# EAGLE design BigFrontplane (EAGLE 6.6.0)
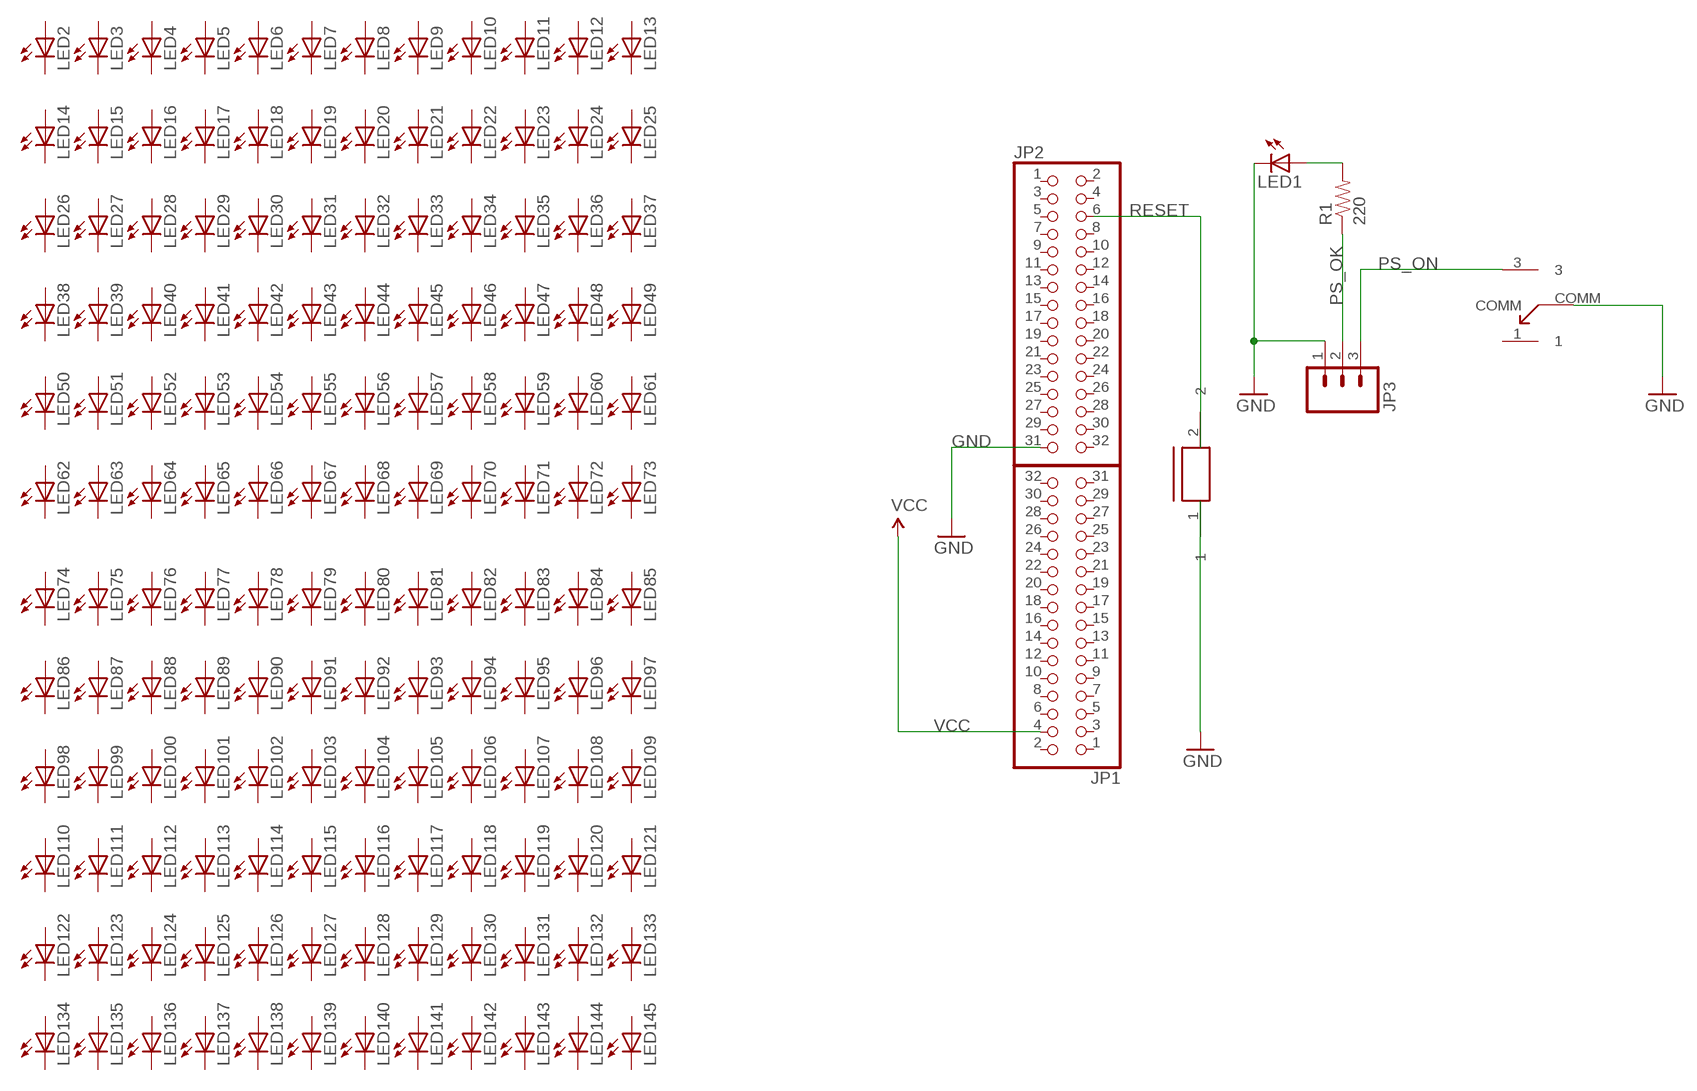
[diagram p0: schematic, sheet 1]

## Parts
JP1  PINHD-2X16  [2X16]
JP2  PINHD-2X16  [2X16]
JP3  M03LONGPADS  [1X03_LONGPADS]
LED1  LED5MM  [LED5MM]
LED2  LED3MM  [LED3MM]
LED3  LED3MM  [LED3MM]
LED4  LED3MM  [LED3MM]
LED5  LED3MM  [LED3MM]
LED6  LED3MM  [LED3MM]
LED7  LED3MM  [LED3MM]
LED8  LED3MM  [LED3MM]
LED9  LED3MM  [LED3MM]
LED10  LED3MM  [LED3MM]
LED11  LED3MM  [LED3MM]
LED12  LED3MM  [LED3MM]
LED13  LED3MM  [LED3MM]
LED14  LED3MM  [LED3MM]
LED15  LED3MM  [LED3MM]
LED16  LED3MM  [LED3MM]
LED17  LED3MM  [LED3MM]
LED18  LED3MM  [LED3MM]
LED19  LED3MM  [LED3MM]
LED20  LED3MM  [LED3MM]
LED21  LED3MM  [LED3MM]
LED22  LED3MM  [LED3MM]
LED23  LED3MM  [LED3MM]
LED24  LED3MM  [LED3MM]
LED25  LED3MM  [LED3MM]
LED26  LED3MM  [LED3MM]
LED27  LED3MM  [LED3MM]
LED28  LED3MM  [LED3MM]
LED29  LED3MM  [LED3MM]
LED30  LED3MM  [LED3MM]
LED31  LED3MM  [LED3MM]
LED32  LED3MM  [LED3MM]
LED33  LED3MM  [LED3MM]
LED34  LED3MM  [LED3MM]
LED35  LED3MM  [LED3MM]
LED36  LED3MM  [LED3MM]
LED37  LED3MM  [LED3MM]
LED38  LED3MM  [LED3MM]
LED39  LED3MM  [LED3MM]
LED40  LED3MM  [LED3MM]
LED41  LED3MM  [LED3MM]
LED42  LED3MM  [LED3MM]
LED43  LED3MM  [LED3MM]
LED44  LED3MM  [LED3MM]
LED45  LED3MM  [LED3MM]
LED46  LED3MM  [LED3MM]
LED47  LED3MM  [LED3MM]
LED48  LED3MM  [LED3MM]
LED49  LED3MM  [LED3MM]
LED50  LED3MM  [LED3MM]
LED51  LED3MM  [LED3MM]
LED52  LED3MM  [LED3MM]
LED53  LED3MM  [LED3MM]
LED54  LED3MM  [LED3MM]
LED55  LED3MM  [LED3MM]
LED56  LED3MM  [LED3MM]
LED57  LED3MM  [LED3MM]
LED58  LED3MM  [LED3MM]
LED59  LED3MM  [LED3MM]
LED60  LED3MM  [LED3MM]
LED61  LED3MM  [LED3MM]
LED62  LED3MM  [LED3MM]
LED63  LED3MM  [LED3MM]
LED64  LED3MM  [LED3MM]
LED65  LED3MM  [LED3MM]
LED66  LED3MM  [LED3MM]
LED67  LED3MM  [LED3MM]
LED68  LED3MM  [LED3MM]
LED69  LED3MM  [LED3MM]
LED70  LED3MM  [LED3MM]
LED71  LED3MM  [LED3MM]
LED72  LED3MM  [LED3MM]
LED73  LED3MM  [LED3MM]
LED74  LED3MM  [LED3MM]
LED75  LED3MM  [LED3MM]
LED76  LED3MM  [LED3MM]
LED77  LED3MM  [LED3MM]
LED78  LED3MM  [LED3MM]
LED79  LED3MM  [LED3MM]
LED80  LED3MM  [LED3MM]
LED81  LED3MM  [LED3MM]
LED82  LED3MM  [LED3MM]
LED83  LED3MM  [LED3MM]
LED84  LED3MM  [LED3MM]
LED85  LED3MM  [LED3MM]
LED86  LED3MM  [LED3MM]
LED87  LED3MM  [LED3MM]
LED88  LED3MM  [LED3MM]
LED89  LED3MM  [LED3MM]
LED90  LED3MM  [LED3MM]
LED91  LED3MM  [LED3MM]
LED92  LED3MM  [LED3MM]
LED93  LED3MM  [LED3MM]
LED94  LED3MM  [LED3MM]
LED95  LED3MM  [LED3MM]
LED96  LED3MM  [LED3MM]
LED97  LED3MM  [LED3MM]
LED98  LED3MM  [LED3MM]
LED99  LED3MM  [LED3MM]
LED100  LED3MM  [LED3MM]
LED101  LED3MM  [LED3MM]
LED102  LED3MM  [LED3MM]
LED103  LED3MM  [LED3MM]
LED104  LED3MM  [LED3MM]
LED105  LED3MM  [LED3MM]
LED106  LED3MM  [LED3MM]
LED107  LED3MM  [LED3MM]
LED108  LED3MM  [LED3MM]
LED109  LED3MM  [LED3MM]
LED110  LED3MM  [LED3MM]
LED111  LED3MM  [LED3MM]
LED112  LED3MM  [LED3MM]
LED113  LED3MM  [LED3MM]
LED114  LED3MM  [LED3MM]
LED115  LED3MM  [LED3MM]
LED116  LED3MM  [LED3MM]
LED117  LED3MM  [LED3MM]
LED118  LED3MM  [LED3MM]
LED119  LED3MM  [LED3MM]
LED120  LED3MM  [LED3MM]
LED121  LED3MM  [LED3MM]
LED122  LED3MM  [LED3MM]
LED123  LED3MM  [LED3MM]
LED124  LED3MM  [LED3MM]
LED125  LED3MM  [LED3MM]
LED126  LED3MM  [LED3MM]
LED127  LED3MM  [LED3MM]
LED128  LED3MM  [LED3MM]
LED129  LED3MM  [LED3MM]
LED130  LED3MM  [LED3MM]
LED131  LED3MM  [LED3MM]
LED132  LED3MM  [LED3MM]
LED133  LED3MM  [LED3MM]
LED134  LED3MM  [LED3MM]
LED135  LED3MM  [LED3MM]
LED136  LED3MM  [LED3MM]
LED137  LED3MM  [LED3MM]
LED138  LED3MM  [LED3MM]
LED139  LED3MM  [LED3MM]
LED140  LED3MM  [LED3MM]
LED141  LED3MM  [LED3MM]
LED142  LED3MM  [LED3MM]
LED143  LED3MM  [LED3MM]
LED144  LED3MM  [LED3MM]
LED145  LED3MM  [LED3MM]
R1  220  RESISTORKIT  [AXIAL-0.3-KIT]
U$1  7101  [7101SYCQE]
U$2  TP11  [TP11]

## Nets
GND: JP2.31 JP3.1 LED1.K(C) U$1.COMM U$2.1
N$1: LED1.A R1.P$2
PS_OK: JP3.2 R1.P$1
PS_ON: JP3.3 U$1.3
RESET: JP2.6 U$2.2
VCC: JP1.4
Unconnected: JP1.1 JP1.2 JP1.3 JP1.5 JP1.6 JP1.7 JP1.8 JP1.9 JP1.10 JP1.11 JP1.12 JP1.13 JP1.14 JP1.15 JP1.16 JP1.17 JP1.18 JP1.19 JP1.20 JP1.21 JP1.22 JP1.23 JP1.24 JP1.25 JP1.26 JP1.27 JP1.28 JP1.29 JP1.30 JP1.31 JP1.32 JP2.1 JP2.2 JP2.3 JP2.4 JP2.5 JP2.7 JP2.8 JP2.9 JP2.10 JP2.11 JP2.12 JP2.13 JP2.14 JP2.15 JP2.16 JP2.17 JP2.18 JP2.19 JP2.20 JP2.21 JP2.22 JP2.23 JP2.24 JP2.25 JP2.26 JP2.27 JP2.28 JP2.29 JP2.30 JP2.32 LED2.A LED2.K(C) LED3.A LED3.K(C) LED4.A LED4.K(C) LED5.A LED5.K(C) LED6.A LED6.K(C) LED7.A LED7.K(C) LED8.A LED8.K(C) LED9.A LED9.K(C) LED10.A LED10.K(C) LED11.A LED11.K(C) LED12.A LED12.K(C) LED13.A LED13.K(C) LED14.A LED14.K(C) LED15.A LED15.K(C) LED16.A LED16.K(C) LED17.A LED17.K(C) LED18.A LED18.K(C) LED19.A LED19.K(C) LED20.A LED20.K(C) LED21.A LED21.K(C) LED22.A LED22.K(C) LED23.A LED23.K(C) LED24.A LED24.K(C) LED25.A LED25.K(C) LED26.A LED26.K(C) LED27.A LED27.K(C) LED28.A LED28.K(C) LED29.A LED29.K(C) LED30.A LED30.K(C) LED31.A LED31.K(C) LED32.A LED32.K(C) LED33.A LED33.K(C) LED34.A LED34.K(C) LED35.A LED35.K(C) LED36.A LED36.K(C) LED37.A LED37.K(C) LED38.A LED38.K(C) LED39.A LED39.K(C) LED40.A LED40.K(C) LED41.A LED41.K(C) LED42.A LED42.K(C) LED43.A LED43.K(C) LED44.A LED44.K(C) LED45.A LED45.K(C) LED46.A LED46.K(C) LED47.A LED47.K(C) LED48.A LED48.K(C) LED49.A LED49.K(C) LED50.A LED50.K(C) LED51.A LED51.K(C) LED52.A LED52.K(C) LED53.A LED53.K(C) LED54.A LED54.K(C) LED55.A LED55.K(C) LED56.A LED56.K(C) LED57.A LED57.K(C) LED58.A LED58.K(C) LED59.A LED59.K(C) LED60.A LED60.K(C) LED61.A LED61.K(C) LED62.A LED62.K(C) LED63.A LED63.K(C) LED64.A LED64.K(C) LED65.A LED65.K(C) LED66.A LED66.K(C) LED67.A LED67.K(C) LED68.A LED68.K(C) LED69.A LED69.K(C) LED70.A LED70.K(C) LED71.A LED71.K(C) LED72.A LED72.K(C) LED73.A LED73.K(C) LED74.A LED74.K(C) LED75.A LED75.K(C) LED76.A LED76.K(C) LED77.A LED77.K(C) LED78.A LED78.K(C) LED79.A LED79.K(C) LED80.A LED80.K(C) LED81.A LED81.K(C) LED82.A LED82.K(C) LED83.A LED83.K(C) LED84.A LED84.K(C) LED85.A LED85.K(C) LED86.A LED86.K(C) LED87.A LED87.K(C) LED88.A LED88.K(C) LED89.A LED89.K(C) LED90.A LED90.K(C) LED91.A LED91.K(C) LED92.A LED92.K(C) LED93.A LED93.K(C) LED94.A LED94.K(C) LED95.A LED95.K(C) LED96.A LED96.K(C) LED97.A LED97.K(C) LED98.A LED98.K(C) LED99.A LED99.K(C) LED100.A LED100.K(C) LED101.A LED101.K(C) LED102.A LED102.K(C) LED103.A LED103.K(C) LED104.A LED104.K(C) LED105.A LED105.K(C) LED106.A LED106.K(C) LED107.A LED107.K(C) LED108.A LED108.K(C) LED109.A LED109.K(C) LED110.A LED110.K(C) LED111.A LED111.K(C) LED112.A LED112.K(C) LED113.A LED113.K(C) LED114.A LED114.K(C) LED115.A LED115.K(C) LED116.A LED116.K(C) LED117.A LED117.K(C) LED118.A LED118.K(C) LED119.A LED119.K(C) LED120.A LED120.K(C) LED121.A LED121.K(C) LED122.A LED122.K(C) LED123.A LED123.K(C) LED124.A LED124.K(C) LED125.A LED125.K(C) LED126.A LED126.K(C) LED127.A LED127.K(C) LED128.A LED128.K(C) LED129.A LED129.K(C) LED130.A LED130.K(C) LED131.A LED131.K(C) LED132.A LED132.K(C) LED133.A LED133.K(C) LED134.A LED134.K(C) LED135.A LED135.K(C) LED136.A LED136.K(C) LED137.A LED137.K(C) LED138.A LED138.K(C) LED139.A LED139.K(C) LED140.A LED140.K(C) LED141.A LED141.K(C) LED142.A LED142.K(C) LED143.A LED143.K(C) LED144.A LED144.K(C) LED145.A LED145.K(C) U$1.1

## Library data of the parts
JP1 JP2 = pinhead:PINHD-2X16: PIN HEADER
JP3 = SparkFun-Connectors:M03: Header 3 Standard 3-pin 0.1" header. Use with straight break away headers (SKU : PRT-00116), right angle break away headers (PRT-00553), swiss pins (PRT-00743), machine pins (PRT-00117), and female headers (PRT-00115). Molex polarized connector foot print use with SKU : PRT-08232 with associated crimp pins and housings.
LED1 = led:LED: LED
LED2-LED145 = adafruit:LED: LED
R1 = SparkFun-Resistors:RESISTOR: Resistor Basic schematic elements and footprints for 0603, 1206, and PTH resistors.
U$1 = C&K:7101
U$2 = C&K:TP11

## Board
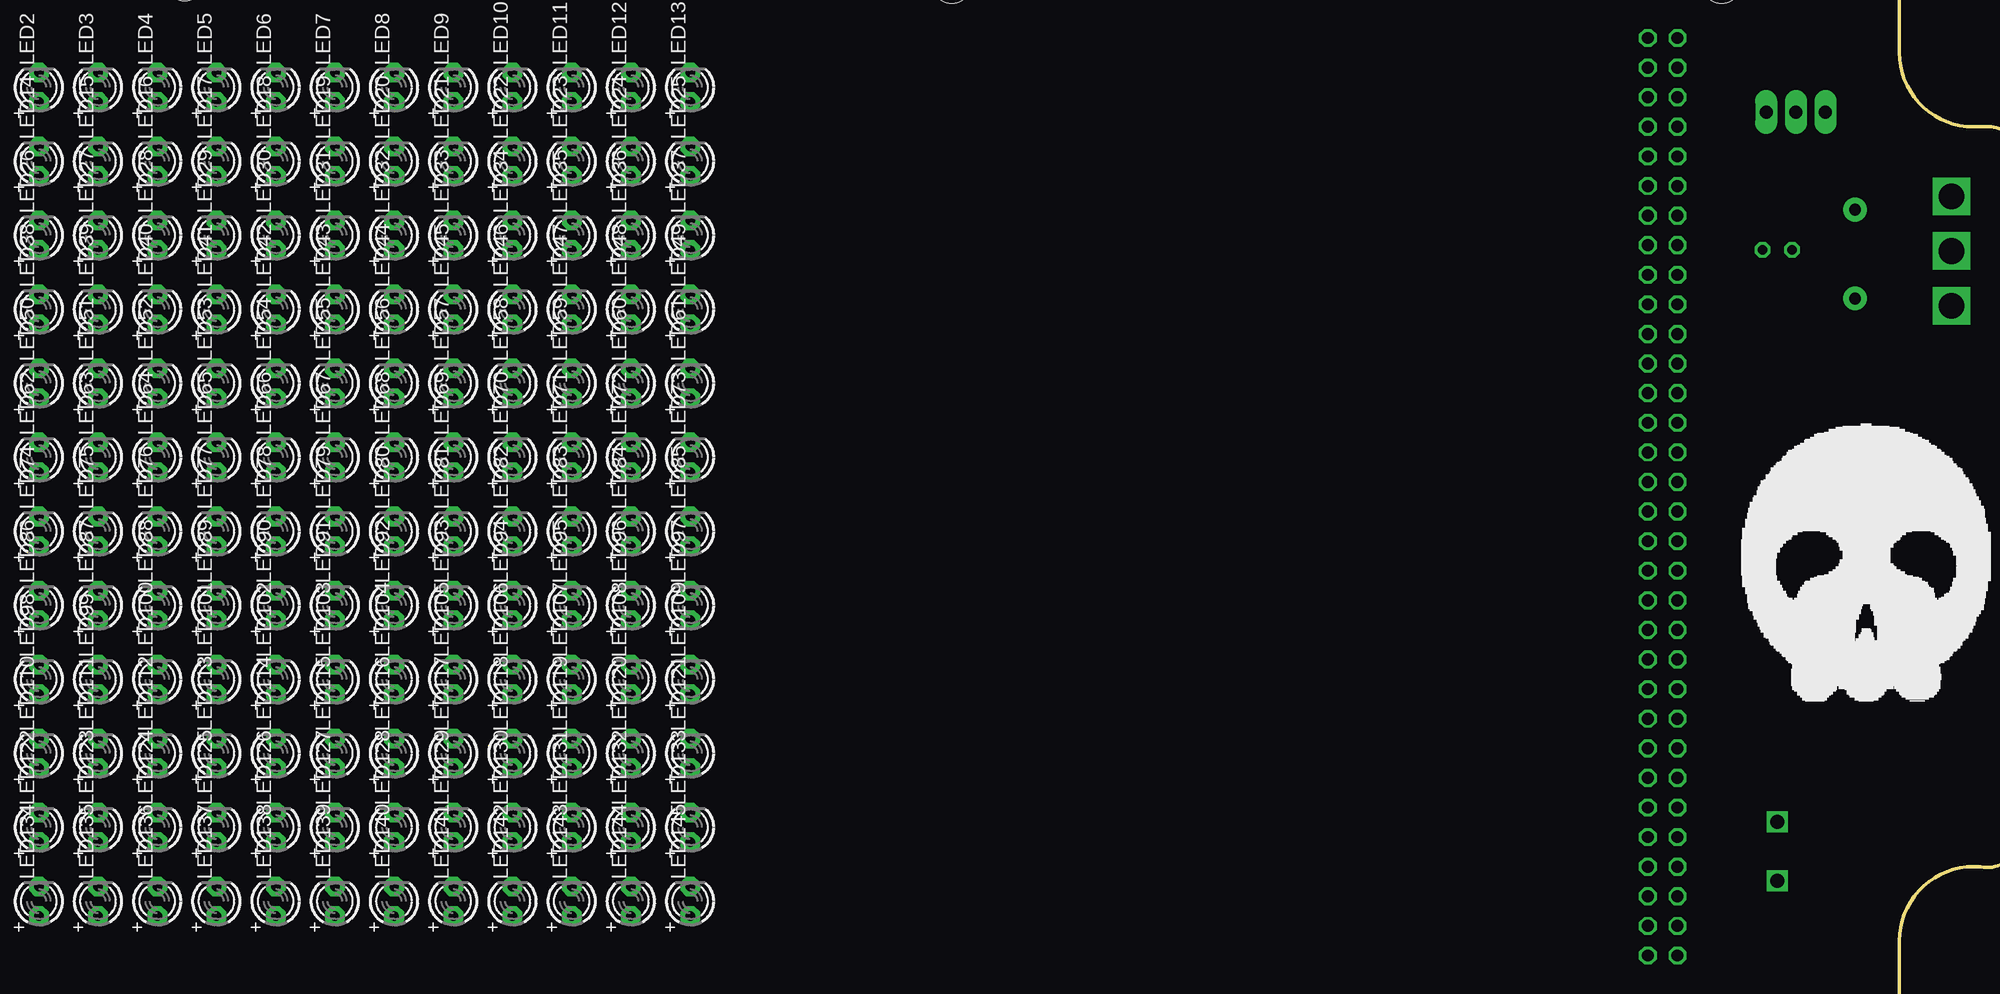
[diagram p1: board, top side]
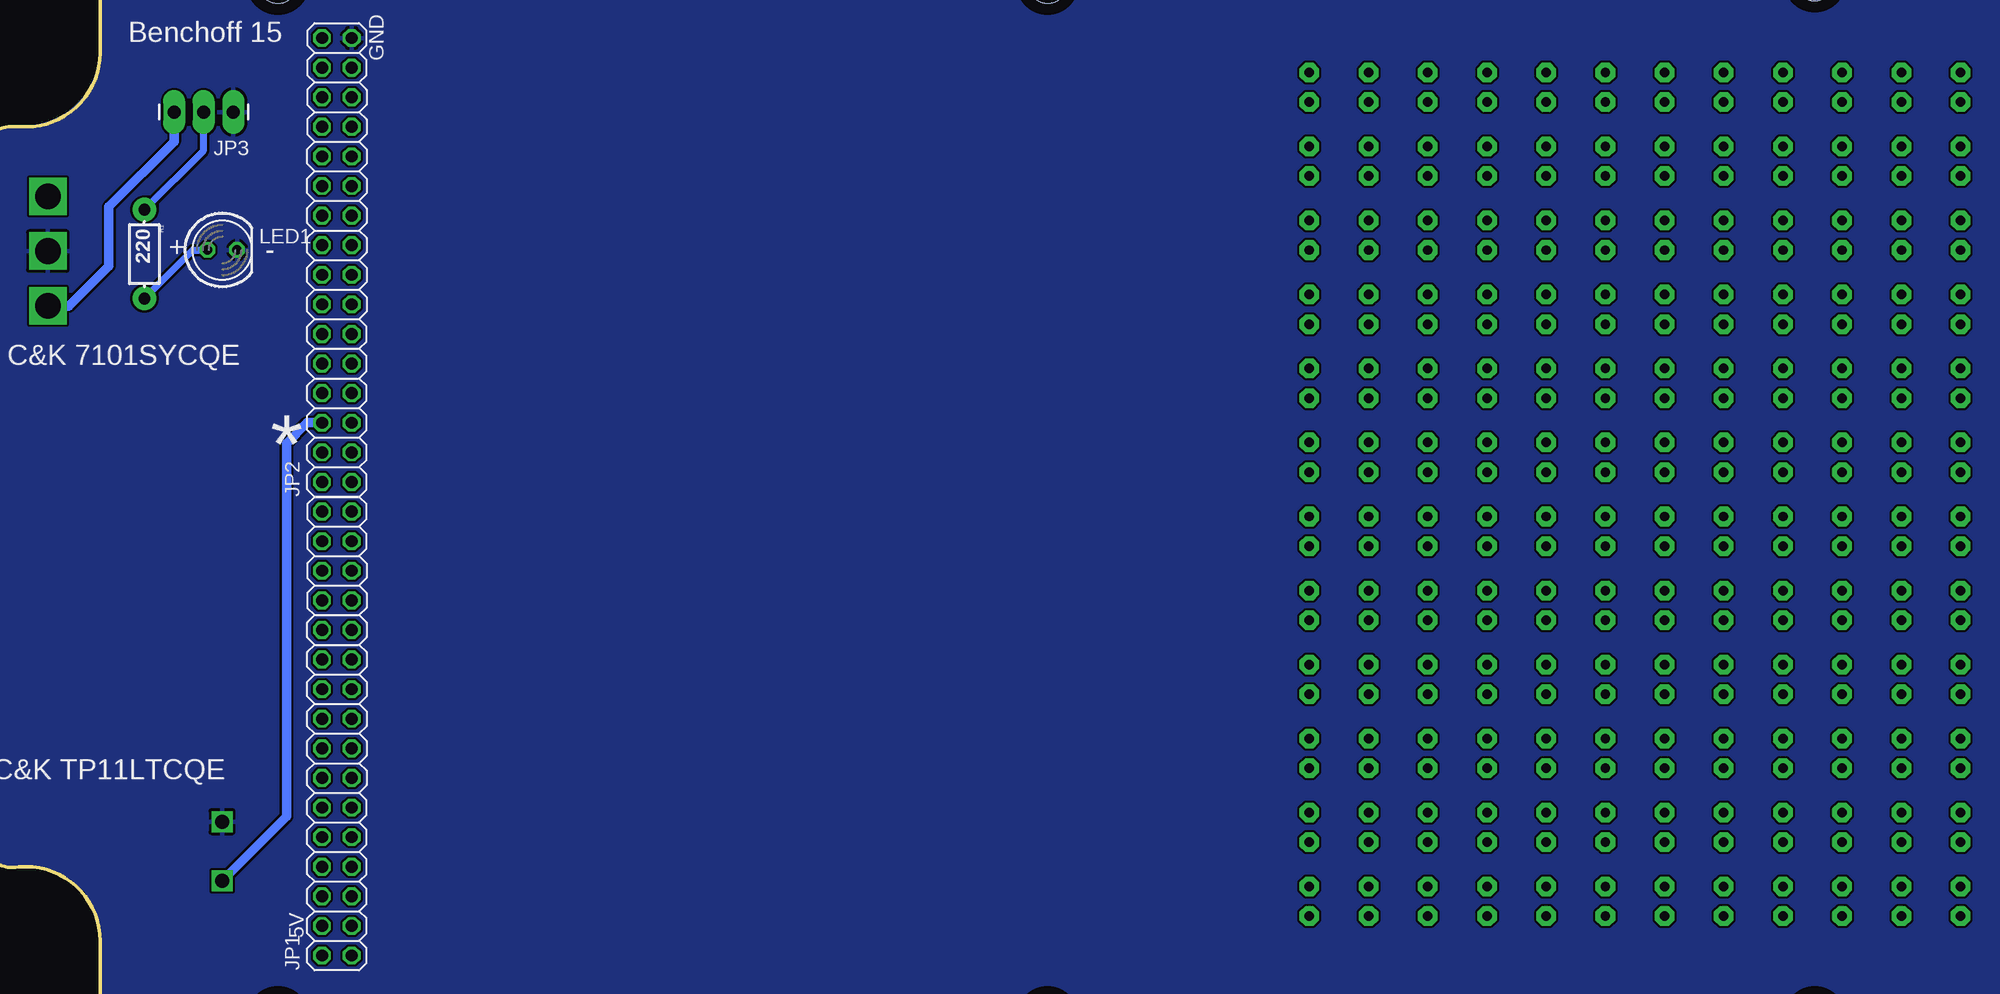
[diagram p2: board, bottom side, seen from below]

No outline drawn. Coordinates in mm, seen from the top.
Copper layers (1*16): Top 0.035mm / dielectric 1.5mm / Bottom 0.035mm
Design rules "default": minimum track width 10mil, minimum drill 24mil, track to track 8mil, track to pad 8mil, pad to pad 8mil, via to via 8mil, smd to smd 8mil, copper to edge 40mil, drill to drill 8mil, minimum pad ring 10mil, minimum via ring 8mil, stop-mask expansion 4mil, vias tented up to drill 0mil, thermal gap 10mil
Milling: 32 lines

### Footprints (pad centres in the part's own frame; a part is rotated, then mirrored left to right if it is on the bottom)
2X16 = drill 1.016 octagon: 1 -19.05,-1.27; 2 -19.05,1.27; 3 -16.51,-1.27; 4 -16.51,1.27; 5 -13.97,-1.27; 6 -13.97,1.27; 7 -11.43,-1.27; 8 -11.43,1.27; 9 -8.89,-1.27; 10 -8.89,1.27; 11 -6.35,-1.27; 12 -6.35,1.27; 13 -3.81,-1.27; 14 -3.81,1.27; 15 -1.27,-1.27; 16 -1.27,1.27; 17 1.27,-1.27; 18 1.27,1.27; 19 3.81,-1.27; 20 3.81,1.27; 21 6.35,-1.27; 22 6.35,1.27; 23 8.89,-1.27; 24 8.89,1.27; 25 11.43,-1.27; 26 11.43,1.27; 27 13.97,-1.27; 28 13.97,1.27; 29 16.51,-1.27; 30 16.51,1.27; 31 19.05,-1.27; 32 19.05,1.27
1X03_LONGPADS = drill 1.118 pad 1.88 long: 1 0,0; 2 2.54,0; 3 5.08,0
LED5MM = drill 0.813 octagon: A -1.27,0; K 1.27,0
LED3MM = drill 0.813 pad 1.676 octagon: A -1.27,0; K 1.27,0
AXIAL-0.3-KIT = drill 1.016 pad 2.032: P$1 -3.81,0; P$2 3.81,0
7101SYCQE = drill 2.2 square: 1 0,4.699; 3 0,-4.699; COMM 0,0
TP11 = drill 1.2 square: 1 0,2.54; 2 0,-2.54
STAND-OFF = hole 3.302: 0,0

### Placement (x,y rotation side)
JP1  158.37,30.9 90 bottom
JP2  158.37,71.54 90 bottom
JP3  167.26,84.24 180 bottom
LED1  168.2,72.41 0 bottom
LED2  19.05,86.36 90 top
LED3  24.13,86.36 90 top
LED4  29.21,86.36 90 top
LED5  34.29,86.36 90 top
LED6  39.37,86.36 90 top
LED7  44.45,86.36 90 top
LED8  49.53,86.36 90 top
LED9  54.61,86.36 90 top
LED10  59.69,86.36 90 top
LED11  64.77,86.36 90 top
LED12  69.85,86.36 90 top
LED13  74.93,86.36 90 top
LED14  19.05,80.01 90 top
LED15  24.13,80.01 90 top
LED16  29.21,80.01 90 top
LED17  34.29,80.01 90 top
LED18  39.37,80.01 90 top
LED19  44.45,80.01 90 top
LED20  49.53,80.01 90 top
LED21  54.61,80.01 90 top
LED22  59.69,80.01 90 top
LED23  64.77,80.01 90 top
LED24  69.85,80.01 90 top
LED25  74.93,80.01 90 top
LED26  19.05,73.66 90 top
LED27  24.13,73.66 90 top
LED28  29.21,73.66 90 top
LED29  34.29,73.66 90 top
LED30  39.37,73.66 90 top
LED31  44.45,73.66 90 top
LED32  49.53,73.66 90 top
LED33  54.61,73.66 90 top
LED34  59.69,73.66 90 top
LED35  64.77,73.66 90 top
LED36  69.85,73.66 90 top
LED37  74.93,73.66 90 top
LED38  19.05,67.31 90 top
LED39  24.13,67.31 90 top
LED40  29.21,67.31 90 top
LED41  34.29,67.31 90 top
LED42  39.37,67.31 90 top
LED43  44.45,67.31 90 top
LED44  49.53,67.31 90 top
LED45  54.61,67.31 90 top
LED46  59.69,67.31 90 top
LED47  64.77,67.31 90 top
LED48  69.85,67.31 90 top
LED49  74.93,67.31 90 top
LED50  19.05,60.96 90 top
LED51  24.13,60.96 90 top
LED52  29.21,60.96 90 top
LED53  34.29,60.96 90 top
LED54  39.37,60.96 90 top
LED55  44.45,60.96 90 top
LED56  49.53,60.96 90 top
LED57  54.61,60.96 90 top
LED58  59.69,60.96 90 top
LED59  64.77,60.96 90 top
LED60  69.85,60.96 90 top
LED61  74.93,60.96 90 top
LED62  19.05,54.61 90 top
LED63  24.13,54.61 90 top
LED64  29.21,54.61 90 top
LED65  34.29,54.61 90 top
LED66  39.37,54.61 90 top
LED67  44.45,54.61 90 top
LED68  49.53,54.61 90 top
LED69  54.61,54.61 90 top
LED70  59.69,54.61 90 top
LED71  64.77,54.61 90 top
LED72  69.85,54.61 90 top
LED73  74.93,54.61 90 top
LED74  19.05,48.26 90 top
LED75  24.13,48.26 90 top
LED76  29.21,48.26 90 top
LED77  34.29,48.26 90 top
LED78  39.37,48.26 90 top
LED79  44.45,48.26 90 top
LED80  49.53,48.26 90 top
LED81  54.61,48.26 90 top
LED82  59.69,48.26 90 top
LED83  64.77,48.26 90 top
LED84  69.85,48.26 90 top
LED85  74.93,48.26 90 top
LED86  19.05,41.91 90 top
LED87  24.13,41.91 90 top
LED88  29.21,41.91 90 top
LED89  34.29,41.91 90 top
LED90  39.37,41.91 90 top
LED91  44.45,41.91 90 top
LED92  49.53,41.91 90 top
LED93  54.61,41.91 90 top
LED94  59.69,41.91 90 top
LED95  64.77,41.91 90 top
LED96  69.85,41.91 90 top
LED97  74.93,41.91 90 top
LED98  19.05,35.56 90 top
LED99  24.13,35.56 90 top
LED100  29.21,35.56 90 top
LED101  34.29,35.56 90 top
LED102  39.37,35.56 90 top
LED103  44.45,35.56 90 top
LED104  49.53,35.56 90 top
LED105  54.61,35.56 90 top
LED106  59.69,35.56 90 top
LED107  64.77,35.56 90 top
LED108  69.85,35.56 90 top
LED109  74.93,35.56 90 top
LED110  19.05,29.21 90 top
LED111  24.13,29.21 90 top
LED112  29.21,29.21 90 top
LED113  34.29,29.21 90 top
LED114  39.37,29.21 90 top
LED115  44.45,29.21 90 top
LED116  49.53,29.21 90 top
LED117  54.61,29.21 90 top
LED118  59.69,29.21 90 top
LED119  64.77,29.21 90 top
LED120  69.85,29.21 90 top
LED121  74.93,29.21 90 top
LED122  19.05,22.86 90 top
LED123  24.13,22.86 90 top
LED124  29.21,22.86 90 top
LED125  34.29,22.86 90 top
LED126  39.37,22.86 90 top
LED127  44.45,22.86 90 top
LED128  49.53,22.86 90 top
LED129  54.61,22.86 90 top
LED130  59.69,22.86 90 top
LED131  64.77,22.86 90 top
LED132  69.85,22.86 90 top
LED133  74.93,22.86 90 top
LED134  19.05,16.51 90 top
LED135  24.13,16.51 90 top
LED136  29.21,16.51 90 top
LED137  34.29,16.51 90 top
LED138  39.37,16.51 90 top
LED139  44.45,16.51 90 top
LED140  49.53,16.51 90 top
LED141  54.61,16.51 90 top
LED142  59.69,16.51 90 top
LED143  64.77,16.51 90 top
LED144  69.85,16.51 90 top
LED145  74.93,16.51 90 top
R1  174.88,72.05 270 bottom
U$1  183.16,72.31 0 bottom
U$2  168.22,20.79 0 bottom
U$3  [STAND-OFF]  97.38,6.56 180 bottom
U$4  [STAND-OFF]  97.38,95.24 180 bottom
U$7  [STAND-OFF]  31.55,6.56 180 bottom
U$8  [STAND-OFF]  31.55,95.46 180 bottom
U$9  [STAND-OFF]  163.42,6.56 180 bottom
U$10  [STAND-OFF]  163.42,95.24 180 bottom

### Tracks (layer width: path | path; a pad name or v marks a point on that pad's centre or on a via)
GND
  pour Bottom: 175.4,98.2 18.03,98.2 arc90 15.27,95.44 15.27,88.87 arc-94 8.27,82.29 arc7 8.06,82.29 7.64,82.29 arc90 5.09,79.75 5.09,21.42 arc90 7.64,18.88 8.48,18.88 8.91,18.88 arc-90 15.27,12.51 15.27,6.36 arc90 18.03,3.61 175.4,3.61 arc90 178.58,6.79 178.58,13.79 arc-90 184.31,19.51 186,19.51 186.43,19.51 arc90 188.76,21.85 188.76,80.38 arc90 186.22,82.93 185.15,82.93 arc-90 178.58,89.5 178.58,95.23 arc94
N$1
  Bottom 0.61: R1.P$2 170.71,72.41 LED1.A
PS_OK
  Bottom 0.61: R1.P$1 169.79,80.94 JP3.2
PS_ON
  Bottom 0.813: JP3.3 172.34,81.7 177.92,76.11 177.92,71.03 181.35,67.61 U$1.3
RESET
  Bottom 0.813: U$2.2 162.68,23.79 162.68,55.8 160.91,57.57 JP2.6

### Text on the board
bPlace: GND | Benchoff 15 | + | - | C&K 7101SYCQE | * | C&K TP11LTCQE | 5V